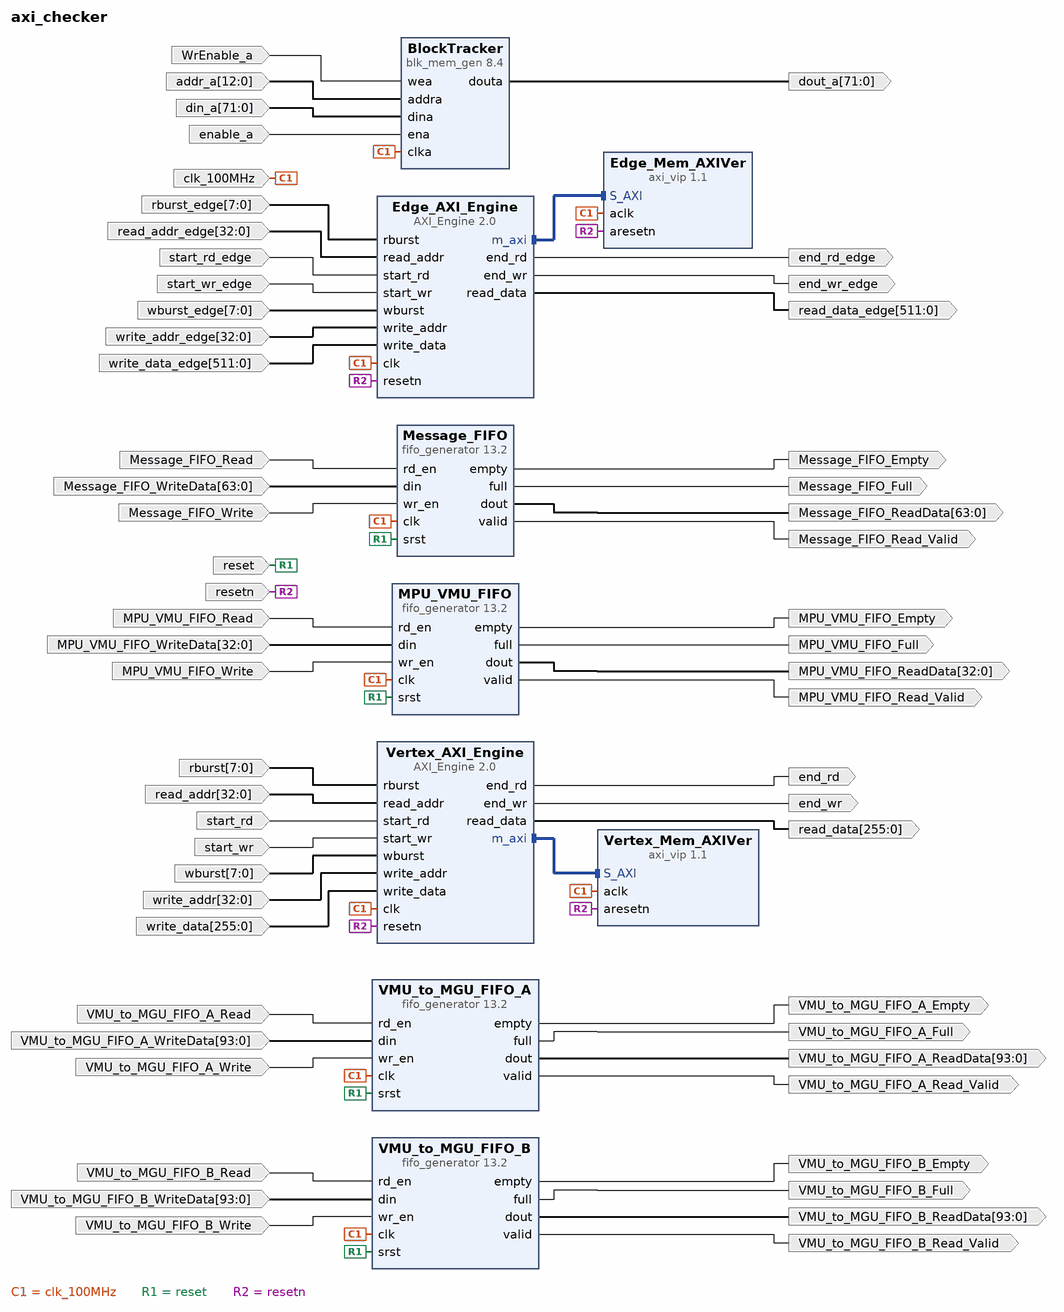
[diagram p0: block diagram of the top level]
# Vivado block design axi_checker, xcu280-fsvh2892-2L-e, Vivado 2022.1
create_bd_design axi_checker

create_bd_port -dir I -type clk clk_100MHz
set_property -dict {CONFIG.ASSOCIATED_RESET resetn:reset CONFIG.FREQ_HZ 100000000} [get_bd_ports clk_100MHz]
create_bd_port -dir I -type rst resetn
set_property -dict {CONFIG.POLARITY ACTIVE_LOW} [get_bd_ports resetn]
create_bd_port -dir I start_rd
create_bd_port -dir I start_wr
create_bd_port -dir O end_wr
create_bd_port -dir O end_rd
create_bd_port -dir I -from 32 -to 0 write_addr
create_bd_port -dir I -from 32 -to 0 read_addr
create_bd_port -dir I -from 255 -to 0 write_data
create_bd_port -dir O -from 255 -to 0 read_data
create_bd_port -dir O end_rd_edge
create_bd_port -dir O -from 511 -to 0 -type data read_data_edge
create_bd_port -dir O end_wr_edge
create_bd_port -dir I start_wr_edge
create_bd_port -dir I start_rd_edge
create_bd_port -dir I -from 32 -to 0 write_addr_edge
create_bd_port -dir I -from 32 -to 0 read_addr_edge
create_bd_port -dir I -from 511 -to 0 -type data write_data_edge
create_bd_port -dir I -from 7 -to 0 rburst
create_bd_port -dir I -from 7 -to 0 rburst_edge
create_bd_port -dir I -from 7 -to 0 wburst
create_bd_port -dir I -from 7 -to 0 wburst_edge
create_bd_port -dir I -from 12 -to 0 addr_a
create_bd_port -dir I -from 71 -to 0 -type data din_a
create_bd_port -dir I enable_a
create_bd_port -dir I WrEnable_a
create_bd_port -dir O -from 71 -to 0 -type data dout_a
create_bd_port -dir O Message_FIFO_Read_Valid
create_bd_port -dir O VMU_to_MGU_FIFO_A_Read_Valid
create_bd_port -dir O VMU_to_MGU_FIFO_B_Read_Valid
create_bd_port -dir O Message_FIFO_Empty
create_bd_port -dir O Message_FIFO_Full
create_bd_port -dir I Message_FIFO_Write
create_bd_port -dir I Message_FIFO_Read
create_bd_port -dir O -from 63 -to 0 Message_FIFO_ReadData
create_bd_port -dir I -from 63 -to 0 Message_FIFO_WriteData
create_bd_port -dir O VMU_to_MGU_FIFO_A_Full
create_bd_port -dir I -from 93 -to 0 VMU_to_MGU_FIFO_A_WriteData
create_bd_port -dir I VMU_to_MGU_FIFO_A_Write
create_bd_port -dir O VMU_to_MGU_FIFO_A_Empty
create_bd_port -dir I VMU_to_MGU_FIFO_A_Read
create_bd_port -dir O -from 93 -to 0 VMU_to_MGU_FIFO_A_ReadData
create_bd_port -dir O VMU_to_MGU_FIFO_B_Full
create_bd_port -dir I -from 93 -to 0 VMU_to_MGU_FIFO_B_WriteData
create_bd_port -dir I VMU_to_MGU_FIFO_B_Write
create_bd_port -dir I VMU_to_MGU_FIFO_B_Read
create_bd_port -dir O -from 93 -to 0 VMU_to_MGU_FIFO_B_ReadData
create_bd_port -dir O VMU_to_MGU_FIFO_B_Empty
create_bd_port -dir I -type rst reset
set_property -dict {CONFIG.POLARITY ACTIVE_HIGH} [get_bd_ports reset]
create_bd_port -dir O MPU_VMU_FIFO_Read_Valid
create_bd_port -dir O MPU_VMU_FIFO_Full
create_bd_port -dir I -from 32 -to 0 MPU_VMU_FIFO_WriteData
create_bd_port -dir I MPU_VMU_FIFO_Write
create_bd_port -dir O MPU_VMU_FIFO_Empty
create_bd_port -dir O -from 32 -to 0 MPU_VMU_FIFO_ReadData
create_bd_port -dir I MPU_VMU_FIFO_Read

create_bd_cell -type ip -vlnv xilinx.com:ip:axi_vip:1.1 Vertex_Mem_AXIVer
set_property -dict {CONFIG.ADDR_WIDTH 33 CONFIG.DATA_WIDTH 256 CONFIG.INTERFACE_MODE SLAVE} [get_bd_cells Vertex_Mem_AXIVer]
create_bd_cell -type ip -vlnv xilinx.com:ip:axi_vip:1.1 Edge_Mem_AXIVer
set_property -dict {CONFIG.ADDR_WIDTH 33 CONFIG.DATA_WIDTH 512 CONFIG.INTERFACE_MODE SLAVE} [get_bd_cells Edge_Mem_AXIVer]
create_bd_cell -type ip -vlnv user.org:user:AXI_Engine:2.0 Vertex_AXI_Engine
create_bd_cell -type ip -vlnv user.org:user:AXI_Engine:2.0 Edge_AXI_Engine
set_property -dict {CONFIG.DATA_WIDTH 512} [get_bd_cells Edge_AXI_Engine]
create_bd_cell -type ip -vlnv xilinx.com:ip:blk_mem_gen:8.4 BlockTracker
set_property -dict [list \
  CONFIG.Enable_32bit_Address false \
  CONFIG.Memory_Type Single_Port_RAM \
  CONFIG.Operating_Mode_A WRITE_FIRST \
  CONFIG.PRIM_type_to_Implement URAM \
  CONFIG.Port_A_Write_Rate 50 \
  CONFIG.Port_B_Clock 0 \
  CONFIG.Port_B_Enable_Rate 0 \
  CONFIG.Port_B_Write_Rate 0 \
  CONFIG.Use_Byte_Write_Enable false \
  CONFIG.Use_RSTA_Pin false \
  CONFIG.Write_Width_A 72 \
  CONFIG.use_bram_block Stand_Alone \
] [get_bd_cells BlockTracker]
create_bd_cell -type ip -vlnv xilinx.com:ip:fifo_generator:13.2 Message_FIFO
set_property -dict [list \
  CONFIG.Input_Data_Width 64 \
  CONFIG.Performance_Options Standard_FIFO \
  CONFIG.Use_Embedded_Registers true \
  CONFIG.Valid_Flag true \
] [get_bd_cells Message_FIFO]
create_bd_cell -type ip -vlnv xilinx.com:ip:fifo_generator:13.2 VMU_to_MGU_FIFO_A
set_property -dict [list \
  CONFIG.Input_Data_Width 94 \
  CONFIG.Performance_Options Standard_FIFO \
  CONFIG.Use_Embedded_Registers true \
  CONFIG.Valid_Flag true \
] [get_bd_cells VMU_to_MGU_FIFO_A]
create_bd_cell -type ip -vlnv xilinx.com:ip:fifo_generator:13.2 VMU_to_MGU_FIFO_B
set_property -dict [list \
  CONFIG.Input_Data_Width 94 \
  CONFIG.Performance_Options Standard_FIFO \
  CONFIG.Use_Embedded_Registers true \
  CONFIG.Valid_Flag true \
] [get_bd_cells VMU_to_MGU_FIFO_B]
create_bd_cell -type ip -vlnv xilinx.com:ip:fifo_generator:13.2 MPU_VMU_FIFO
set_property -dict [list \
  CONFIG.Input_Data_Width 33 \
  CONFIG.Input_Depth 512 \
  CONFIG.Use_Embedded_Registers true \
  CONFIG.Valid_Flag true \
] [get_bd_cells MPU_VMU_FIFO]

# ---- connections ----

connect_bd_intf_net -intf_net AXI_Engine_0_m_axi [get_bd_intf_pins Vertex_AXI_Engine/m_axi] [get_bd_intf_pins Vertex_Mem_AXIVer/S_AXI]
connect_bd_intf_net -intf_net AXI_Engine_1_m_axi [get_bd_intf_pins Edge_AXI_Engine/m_axi] [get_bd_intf_pins Edge_Mem_AXIVer/S_AXI]
connect_bd_net -net AXI_Engine_0_end_rd [get_bd_pins Vertex_AXI_Engine/end_rd] [get_bd_ports end_rd]
connect_bd_net -net AXI_Engine_0_end_wr [get_bd_pins Vertex_AXI_Engine/end_wr] [get_bd_ports end_wr]
connect_bd_net -net AXI_Engine_0_read_data [get_bd_pins Vertex_AXI_Engine/read_data] [get_bd_ports read_data]
connect_bd_net -net AXI_Engine_1_end_rd [get_bd_pins Edge_AXI_Engine/end_rd] [get_bd_ports end_rd_edge]
connect_bd_net -net AXI_Engine_1_end_wr [get_bd_pins Edge_AXI_Engine/end_wr] [get_bd_ports end_wr_edge]
connect_bd_net -net AXI_Engine_1_read_data [get_bd_pins Edge_AXI_Engine/read_data] [get_bd_ports read_data_edge]
connect_bd_net [get_bd_ports MPU_VMU_FIFO_Read] [get_bd_pins MPU_VMU_FIFO/rd_en]
connect_bd_net [get_bd_ports MPU_VMU_FIFO_WriteData] [get_bd_pins MPU_VMU_FIFO/din]
connect_bd_net [get_bd_ports MPU_VMU_FIFO_Write] [get_bd_pins MPU_VMU_FIFO/wr_en]
connect_bd_net [get_bd_ports Message_FIFO_Read] [get_bd_pins Message_FIFO/rd_en]
connect_bd_net [get_bd_ports Message_FIFO_WriteData] [get_bd_pins Message_FIFO/din]
connect_bd_net [get_bd_ports Message_FIFO_Write] [get_bd_pins Message_FIFO/wr_en]
connect_bd_net [get_bd_ports VMU_to_MGU_FIFO_A_Read] [get_bd_pins VMU_to_MGU_FIFO_A/rd_en]
connect_bd_net [get_bd_ports VMU_to_MGU_FIFO_A_WriteData] [get_bd_pins VMU_to_MGU_FIFO_A/din]
connect_bd_net [get_bd_ports VMU_to_MGU_FIFO_A_Write] [get_bd_pins VMU_to_MGU_FIFO_A/wr_en]
connect_bd_net [get_bd_pins VMU_to_MGU_FIFO_A/dout] [get_bd_ports VMU_to_MGU_FIFO_A_ReadData]
connect_bd_net [get_bd_pins VMU_to_MGU_FIFO_A/empty] [get_bd_ports VMU_to_MGU_FIFO_A_Empty]
connect_bd_net [get_bd_pins VMU_to_MGU_FIFO_A/full] [get_bd_ports VMU_to_MGU_FIFO_A_Full]
connect_bd_net [get_bd_ports VMU_to_MGU_FIFO_B_Read] [get_bd_pins VMU_to_MGU_FIFO_B/rd_en]
connect_bd_net [get_bd_ports VMU_to_MGU_FIFO_B_WriteData] [get_bd_pins VMU_to_MGU_FIFO_B/din]
connect_bd_net [get_bd_ports VMU_to_MGU_FIFO_B_Write] [get_bd_pins VMU_to_MGU_FIFO_B/wr_en]
connect_bd_net [get_bd_pins VMU_to_MGU_FIFO_B/dout] [get_bd_ports VMU_to_MGU_FIFO_B_ReadData]
connect_bd_net [get_bd_pins VMU_to_MGU_FIFO_B/empty] [get_bd_ports VMU_to_MGU_FIFO_B_Empty]
connect_bd_net [get_bd_pins VMU_to_MGU_FIFO_B/full] [get_bd_ports VMU_to_MGU_FIFO_B_Full]
connect_bd_net [get_bd_ports WrEnable_a] [get_bd_pins BlockTracker/wea]
connect_bd_net [get_bd_ports addr_a] [get_bd_pins BlockTracker/addra]
connect_bd_net -net blk_mem_gen_0_douta [get_bd_pins BlockTracker/douta] [get_bd_ports dout_a]
connect_bd_net [get_bd_ports clk_100MHz] \
  [get_bd_pins Vertex_Mem_AXIVer/aclk] [get_bd_pins Edge_Mem_AXIVer/aclk] [get_bd_pins Vertex_AXI_Engine/clk] \
  [get_bd_pins Edge_AXI_Engine/clk] [get_bd_pins BlockTracker/clka] [get_bd_pins VMU_to_MGU_FIFO_B/clk] \
  [get_bd_pins VMU_to_MGU_FIFO_A/clk] [get_bd_pins Message_FIFO/clk] [get_bd_pins MPU_VMU_FIFO/clk]
connect_bd_net [get_bd_ports din_a] [get_bd_pins BlockTracker/dina]
connect_bd_net [get_bd_ports enable_a] [get_bd_pins BlockTracker/ena]
connect_bd_net -net fifo_generator_0_dout [get_bd_pins Message_FIFO/dout] [get_bd_ports Message_FIFO_ReadData]
connect_bd_net -net fifo_generator_0_dout1 [get_bd_pins MPU_VMU_FIFO/dout] [get_bd_ports MPU_VMU_FIFO_ReadData]
connect_bd_net -net fifo_generator_0_empty [get_bd_pins Message_FIFO/empty] [get_bd_ports Message_FIFO_Empty]
connect_bd_net -net fifo_generator_0_empty1 [get_bd_pins MPU_VMU_FIFO/empty] [get_bd_ports MPU_VMU_FIFO_Empty]
connect_bd_net -net fifo_generator_0_full [get_bd_pins Message_FIFO/full] [get_bd_ports Message_FIFO_Full]
connect_bd_net -net fifo_generator_0_full1 [get_bd_pins MPU_VMU_FIFO/full] [get_bd_ports MPU_VMU_FIFO_Full]
connect_bd_net -net fifo_generator_0_valid [get_bd_pins Message_FIFO/valid] [get_bd_ports Message_FIFO_Read_Valid]
connect_bd_net -net fifo_generator_0_valid1 [get_bd_pins MPU_VMU_FIFO/valid] [get_bd_ports MPU_VMU_FIFO_Read_Valid]
connect_bd_net -net fifo_generator_1_valid [get_bd_pins VMU_to_MGU_FIFO_A/valid] [get_bd_ports VMU_to_MGU_FIFO_A_Read_Valid]
connect_bd_net -net fifo_generator_2_valid [get_bd_pins VMU_to_MGU_FIFO_B/valid] [get_bd_ports VMU_to_MGU_FIFO_B_Read_Valid]
connect_bd_net [get_bd_ports rburst] [get_bd_pins Vertex_AXI_Engine/rburst]
connect_bd_net [get_bd_ports rburst_edge] [get_bd_pins Edge_AXI_Engine/rburst]
connect_bd_net [get_bd_ports read_addr] [get_bd_pins Vertex_AXI_Engine/read_addr]
connect_bd_net [get_bd_ports read_addr_edge] [get_bd_pins Edge_AXI_Engine/read_addr]
connect_bd_net [get_bd_ports reset] \
  [get_bd_pins Message_FIFO/srst] [get_bd_pins VMU_to_MGU_FIFO_A/srst] [get_bd_pins VMU_to_MGU_FIFO_B/srst] \
  [get_bd_pins MPU_VMU_FIFO/srst]
connect_bd_net [get_bd_ports resetn] \
  [get_bd_pins Vertex_Mem_AXIVer/aresetn] [get_bd_pins Edge_Mem_AXIVer/aresetn] [get_bd_pins Vertex_AXI_Engine/resetn] \
  [get_bd_pins Edge_AXI_Engine/resetn]
connect_bd_net [get_bd_ports start_rd] [get_bd_pins Vertex_AXI_Engine/start_rd]
connect_bd_net [get_bd_ports start_rd_edge] [get_bd_pins Edge_AXI_Engine/start_rd]
connect_bd_net [get_bd_ports start_wr] [get_bd_pins Vertex_AXI_Engine/start_wr]
connect_bd_net [get_bd_ports start_wr_edge] [get_bd_pins Edge_AXI_Engine/start_wr]
connect_bd_net [get_bd_ports wburst] [get_bd_pins Vertex_AXI_Engine/wburst]
connect_bd_net [get_bd_ports wburst_edge] [get_bd_pins Edge_AXI_Engine/wburst]
connect_bd_net [get_bd_ports write_addr] [get_bd_pins Vertex_AXI_Engine/write_addr]
connect_bd_net [get_bd_ports write_addr_edge] [get_bd_pins Edge_AXI_Engine/write_addr]
connect_bd_net [get_bd_ports write_data] [get_bd_pins Vertex_AXI_Engine/write_data]
connect_bd_net [get_bd_ports write_data_edge] [get_bd_pins Edge_AXI_Engine/write_data]

# ---- address map ----
assign_bd_address -offset 0x044A00000 -range 256K -target_address_space [get_bd_addr_spaces Edge_AXI_Engine/m_axi] [get_bd_addr_segs Edge_Mem_AXIVer/S_AXI/Reg]
assign_bd_address -offset 0x044A00000 -range 64K -target_address_space [get_bd_addr_spaces Vertex_AXI_Engine/m_axi] [get_bd_addr_segs Vertex_Mem_AXIVer/S_AXI/Reg]

validate_bd_design
save_bd_design
